# EAGLE design wall (EAGLE 5.10)
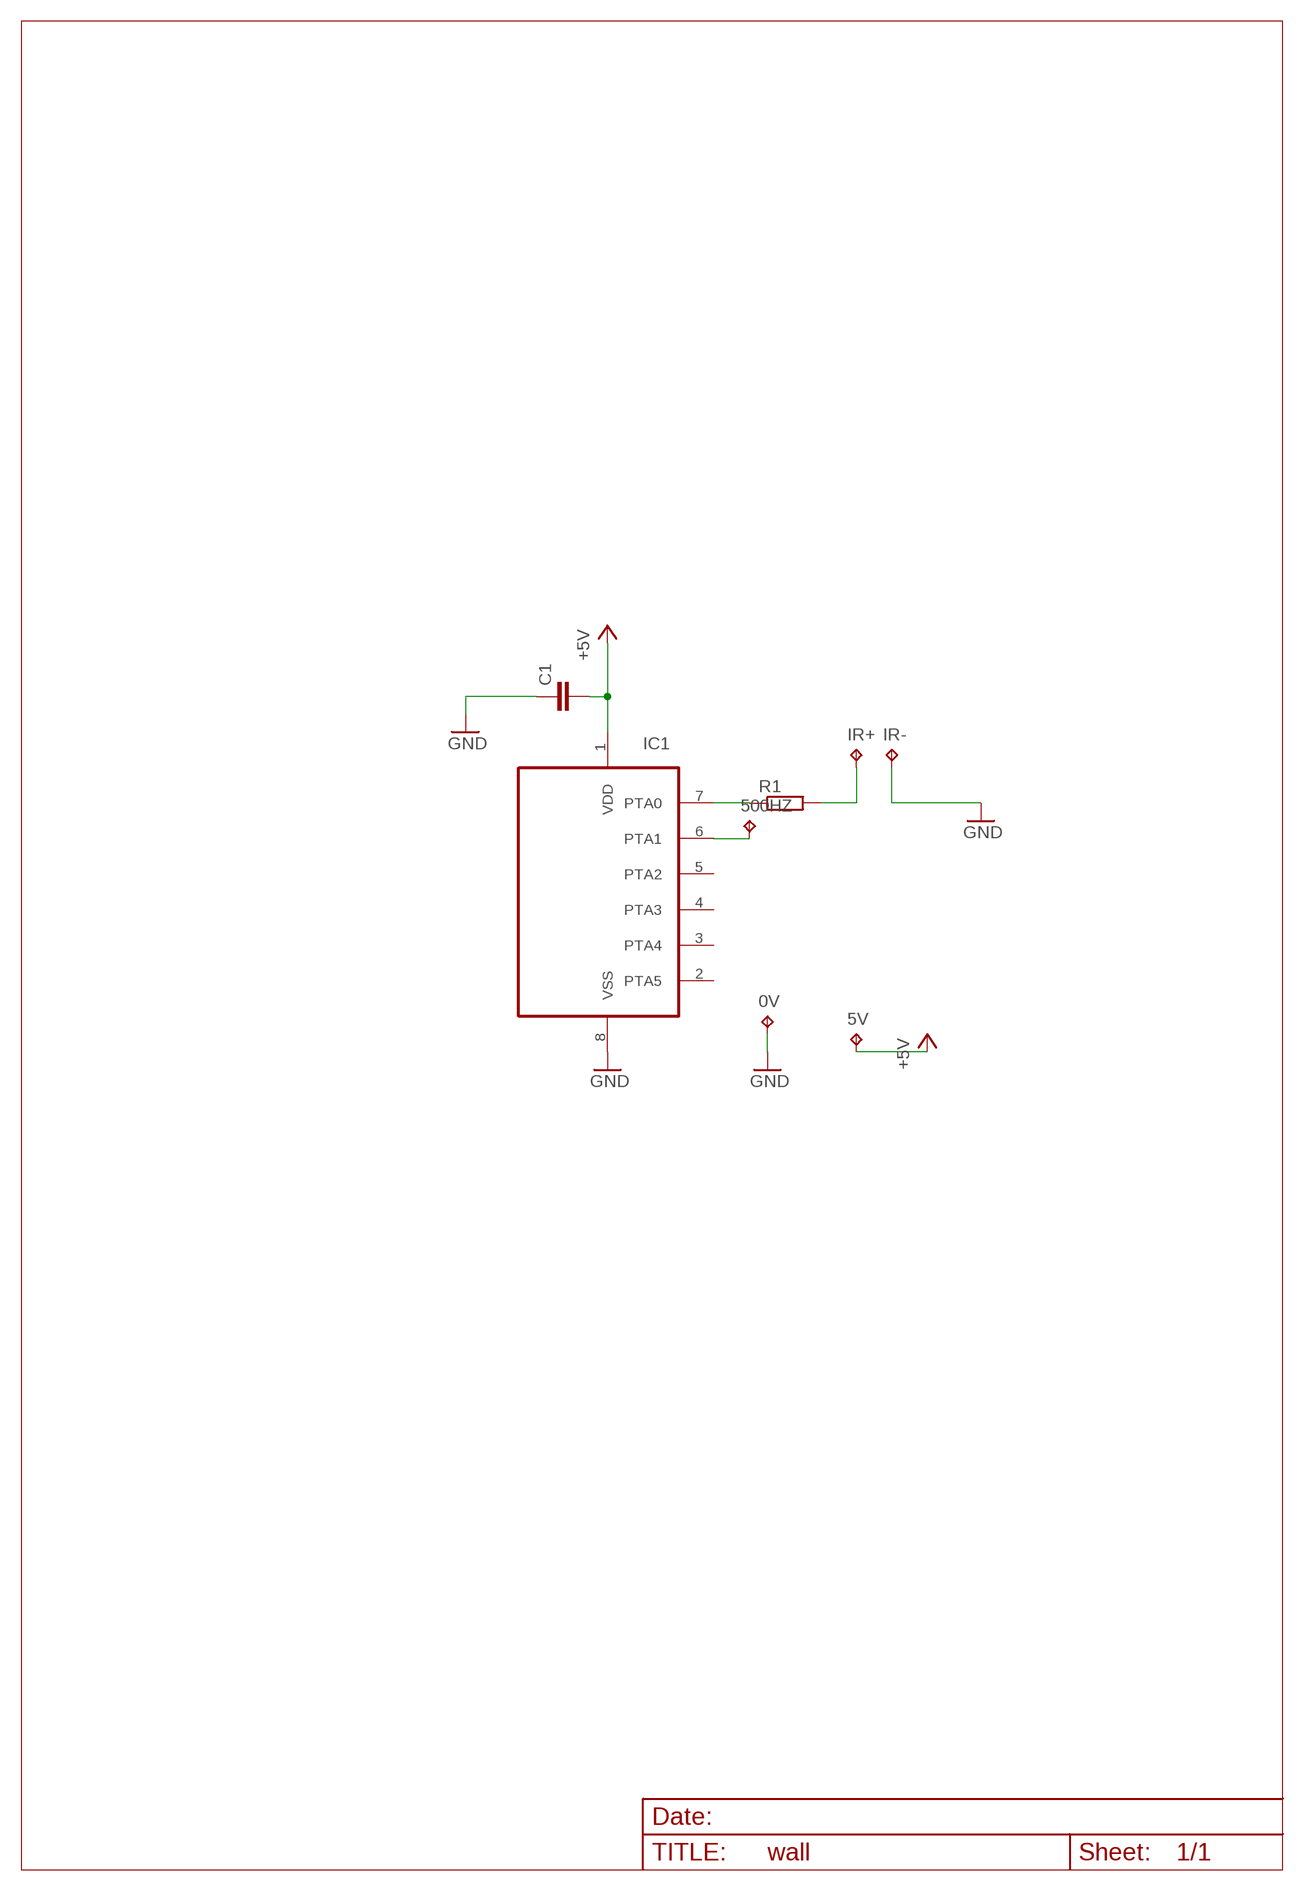
[diagram p0: schematic, sheet 1]

## Parts
0V  TPPAD1-13  [P1-13]
5V  TPPAD1-13  [P1-13]
500HZ  TPPAD1-13  [P1-13]
C1  C-EU075-032X103  [C075-032X103]
IC1  HC908QT  [DIL8]
IR+  TPPAD1-13  [P1-13]
IR-  TPPAD1-13  [P1-13]
R1  R-EU_0204/5  [0204/5]

## Nets
+5V: 5V.TP C1.2 IC1.1(VDD)
GND: 0V.TP C1.1 IC1.8(VSS) IR-.TP
N$1: IC1.7(PTA0) R1.1
N$2: IR+.TP R1.2
N$4: 500HZ.TP IC1.6(PTA1)
Unconnected: IC1.2(PTA5) IC1.3(PTA4) IC1.4(PTA3) IC1.5(PTA2)

## Library data of the parts
0V 5V 500HZ IR+ IR- = testpad:TP: Test pad
C1 = rcl:C-EU: CAPACITOR, European symbol
IC1 = -68hc:HC908QT
R1 = rcl:R-EU_: RESISTOR, European symbol

## Board
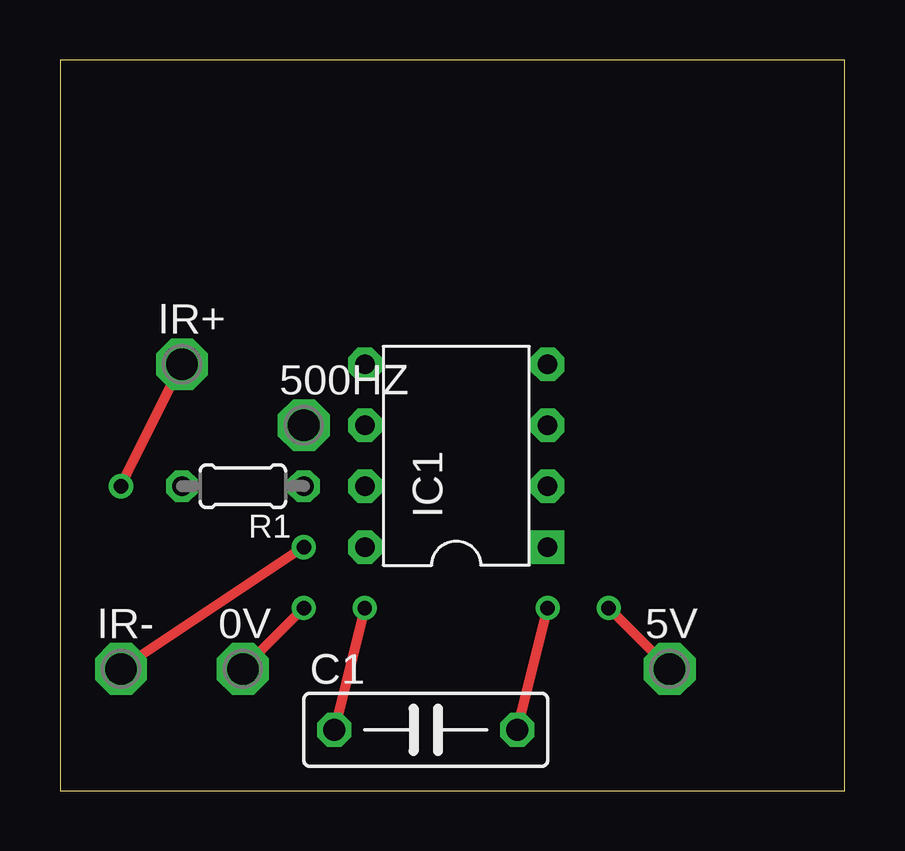
[diagram p1: board, top side]
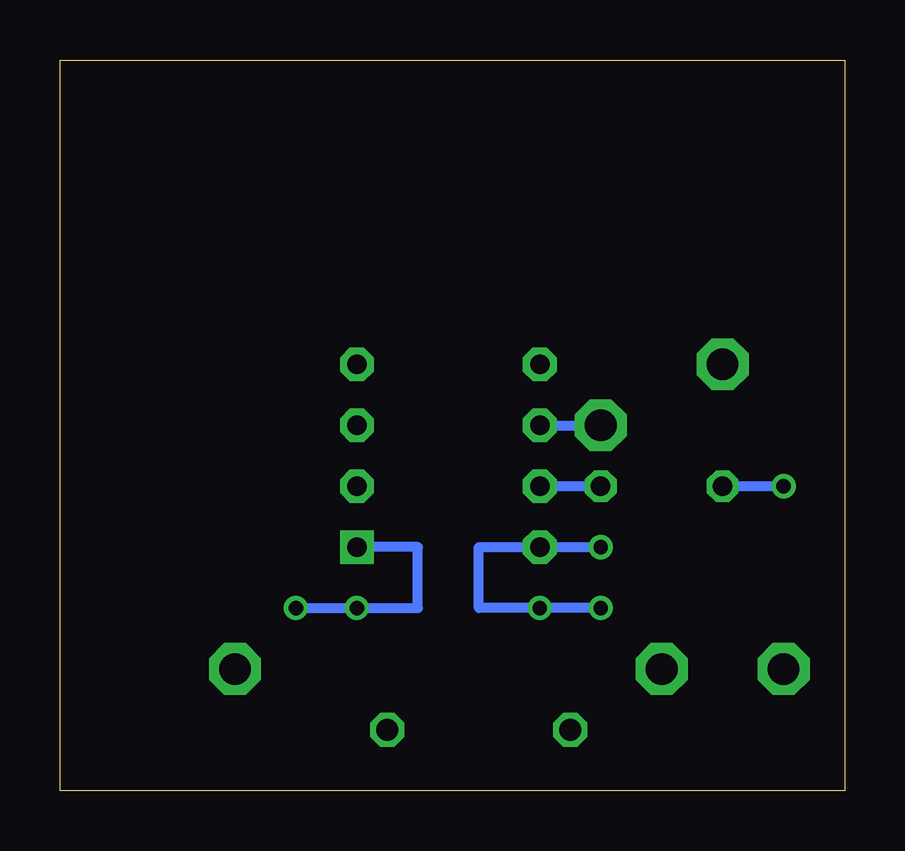
[diagram p2: board, bottom side, seen from below]

Size 32.69 x 30.47 mm. Coordinates in mm from the lower left corner, seen from the top.
Outline: 0,0 32.69,0 32.69,30.47 0,30.47 0,0
Copper layers (1*16): Top 0.035mm / dielectric 1.5mm / Bottom 0.035mm
Design rules "default": minimum track width 10mil, minimum drill 24mil, track to track 8mil, track to pad 8mil, pad to pad 8mil, via to via 8mil, smd to smd 8mil, copper to edge 40mil, drill to drill 8mil, minimum pad ring 10mil, minimum via ring 8mil, stop-mask expansion 4mil, vias tented up to drill 0mil, thermal gap 10mil

### Footprints (pad centres in the part's own frame; a part is rotated, then mirrored left to right if it is on the bottom)
P1-13 = drill 1.321 pad 2.159 octagon: TP 0,0
C075-032X103 = drill 0.914 octagon: 1 -3.81,0; 2 3.81,0
DIL8 = drill 0.813 pad 1.397 square: 1 0,0 | drill 0.813 pad 1.397 octagon: 2 2.54,0; 3 5.08,0; 4 7.62,0; 5 7.62,7.62; 6 5.08,7.62; 7 2.54,7.62; 8 0,7.62
0204/5 = drill 0.813 octagon: 1 -2.54,0; 2 2.54,0

### Placement (x,y rotation side)
0V  7.62,5.08 0 top
5V  25.4,5.08 0 top
500HZ  10.16,15.24 0 top
C1  15.24,2.54 0 top
IC1  20.32,10.16 90 top
IR+  5.08,17.78 0 top
IR-  2.54,5.08 0 top
R1  7.62,12.7 180 top

### Tracks (layer width: path | path; a pad name or v marks a point on that pad's centre or on a via)
+5V  (via drill 0.6)
  Top 0.406: C1.2 v20.32,7.62 | 5V.TP v22.86,7.62
  Bottom 0.406: IC1.1 17.78,10.16 17.78,7.62 v20.32,7.62 v22.86,7.62
GND  (via drill 0.6)
  Top 0.406: v12.7,7.62 C1.1 | 0V.TP v10.16,7.62 | v10.16,10.16 IR-.TP
  Bottom 0.406: v10.16,7.62 v12.7,7.62 15.24,7.62 15.24,10.16 IC1.8 v10.16,10.16
N$1
  Bottom 0.406: IC1.7 R1.1
N$2  (via drill 0.6)
  Top 0.406: v2.54,12.7 IR+.TP
  Bottom 0.406: R1.2 v2.54,12.7
N$4
  Bottom 0.406: IC1.6 500HZ.TP